# EAGLE design OnBoardStampedMetal_Antenna (EAGLE 7.7.0)
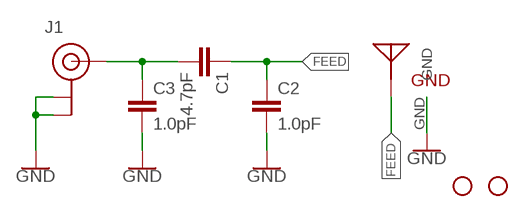
[diagram p0: schematic, sheet 1]

## Parts
C1  4.7pF  4.7PF-0603-50V-5%  [0603]
C2  1.0pF  1.0PF-0603-50V-25%  [0603]
C3  1.0pF  1.0PF-0603-50V-25%  [0603]
H1  STAND-OFF  [STAND-OFF]
H2  STAND-OFF  [STAND-OFF]
J1  U.FL  [U.FL]
U$1  ONBOARD_SMD_STAMPED  [ONBOARD_SMD_STAMPED]

## Nets
FEED: C1.1 C2.1 U$1.FEED
GND: C2.2 C3.2 J1.1(GND) J1.2(GND) U$1.GND
N$1: C1.2 C3.1 J1.FEED(SIGNAL)

## Library data of the parts
C1 = SparkFun-Capacitors:4.7PF: 4.7pF ceramic capacitors A capacitor is a passive two-terminal electrical component used to store electrical energy temporarily in an electric field.; PROD_ID: CAP-07880
C2 C3 = SparkFun-Capacitors:1.0PF: 1pF ceramic capacitors A capacitor is a passive two-terminal electrical component used to store electrical energy temporarily in an electric field.; PROD_ID: CAP-07879
H1 H2 = SparkFun-Hardware:STAND-OFF: Stand Off Drill holes for mechanically mounting via screws, standoffs, etc. Note: Use the keepout ring to avoid running the screw head into surrounding components. Variant Overviews STAND-OFF - Mechanical footprint for a #4 phillips button head screw. STAND-OFF-TIGHT - Mechanical footprint for a #4 phillips button head screw, Example SparkFun Products Screw - Phillips Head (1/4", 4-40, 10 pack) <https://www.sparkfun.com/products/10453> (PRT-10453) Screw - Phillips Head (1/2", 4-40, 10 pack) <https://www.sparkfun.com/products/10452> (PRT-10452) Screw - Phillips Head (3/4", 4-40, 10 pack) <https://www.sparkfun.com/products/10451> (PRT-10451) Screw - Phillips Head (1", 4-40, 10 pack) <https://www.sparkfun.com/products/10450> (PRT-10450)
J1 = SparkFun-Connectors:U.FL: SMD Antenna Connector - U.FL 2mm height, 3.0mm x 3.0mm receptacle size. SparkFun Products: SparkFun WiFi Shield - ESP8266 <https://www.sparkfun.com/products/13287> SparkFun ESP8266 Thing <https://www.sparkfun.com/products/13231> SparkFun MiniGen - Pro Mini Signal Generator Shield <https://www.sparkfun.com/products/11420>; PROD_ID: CONN-09193; SF_ID: WRL-09144
U$1 = SparkX:ONBOARD_SMD_STAMPED

## Board
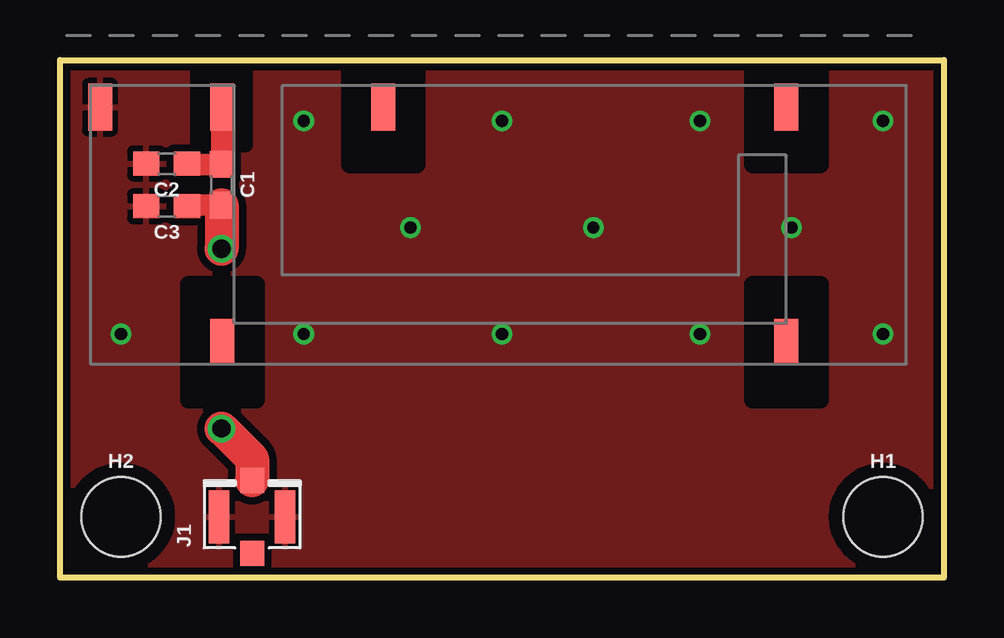
[diagram p1: board, top side]
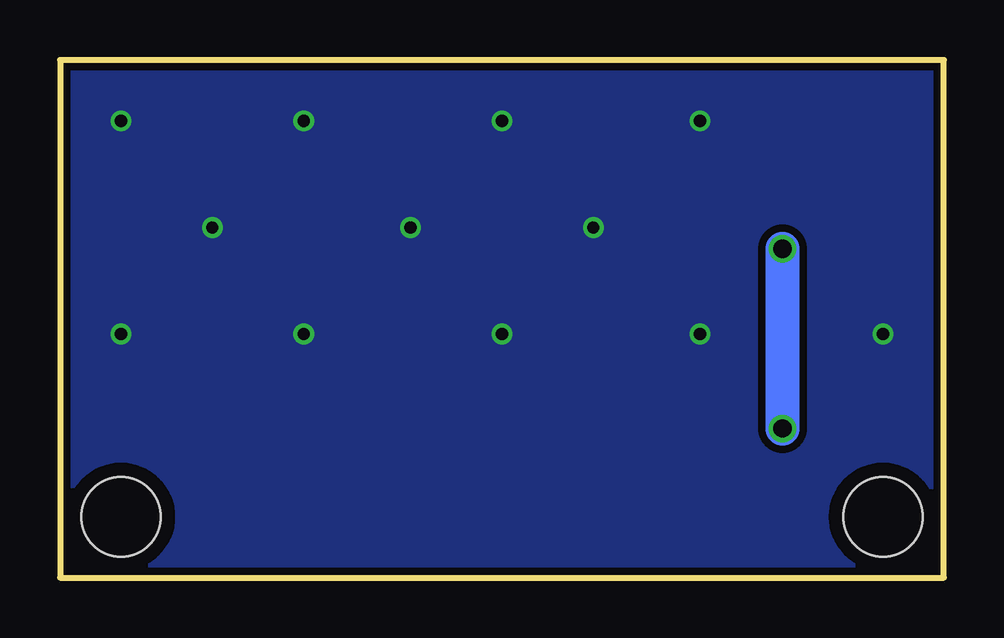
[diagram p2: board, bottom side, seen from below]

Size 36.83 x 21.59 mm. Coordinates in mm from the lower left corner, seen from the top.
Outline: 0,0 0,21.59 36.83,21.59 36.83,0 0,0
Copper layers (1*16): Top 0.035mm / dielectric 1.5mm / Bottom 0.035mm
Design rules "SparkFun-2-layer-PCBWay-LIMIT": minimum track width 6mil, minimum drill 0.3mm, track to track 6mil, track to pad 6mil, pad to pad 6mil, via to via 6mil, smd to smd 6mil, copper to edge 6mil, drill to drill 6mil, minimum pad ring 7mil, minimum via ring 7mil, stop-mask expansion 4mil, vias tented up to drill 25mil, thermal gap 10mil
tRestrict: area 5.7,18 to 7.7,21.2

### Footprints (pad centres in the part's own frame; a part is rotated, then mirrored left to right if it is on the bottom)
0603 = smd 1.1 x 1: 1 -0.85,0; 2 0.85,0
STAND-OFF = hole 3.302: 0,0
U.FL = smd 2.2 x 0.85: 1 0,1.375; 2 0,-1.375 | smd 1.05 x 1: FEED 1.525,0; NC -1.525,0
ONBOARD_SMD_STAMPED = smd 1 x 1.95: FEED 5.5,12; GND 0.4,12; NC@1 12.2,12; NC@2 29,12; NC@3 5.5,2.2; NC@4 29,2.2

### Placement (x,y rotation side)
C1  6.73,16.38 270 top
C2  4.44,17.27 180 top
C3  4.44,15.49 180 top
H1  34.29,2.54 0 top
H2  2.54,2.54 0 top
J1  8,2.54 90 top
U$1  1.27,7.62 0 top

### Tracks (layer width: path | path; a pad name or v marks a point on that pad's centre or on a via)
FEED
  Top 0.889: U$1.FEED 6.73,19.58 C1.1 5.33,17.23 C2.1
GND  (via drill 0.51)
  other vias: 10.16,19.05 2.54,10.16 10.16,10.16 14.6,14.61 18.41,19.05 22.22,14.61 18.41,10.16 26.67,10.16 26.67,19.05 30.48,14.61 34.29,19.05 34.29,10.16
  pour Top (isolate 0.305): 0,21.59 36.83,21.59 36.83,0 0,0
  pour Bottom (isolate 0.305): 0,21.59 36.83,21.59 36.83,0 0,0
N$1  (via drill 0.76)
  Top 0.889: C1.2 5.33,15.53 C3.1
  Top 1.422: C1.2 v6.73,13.72 | v6.73,6.22 8,4.95 J1.FEED
  Bottom 1.422: v6.73,13.72 v6.73,6.22